# EasyEDA schematic SCH_DMM_PCB_Final_2024-05-03.json
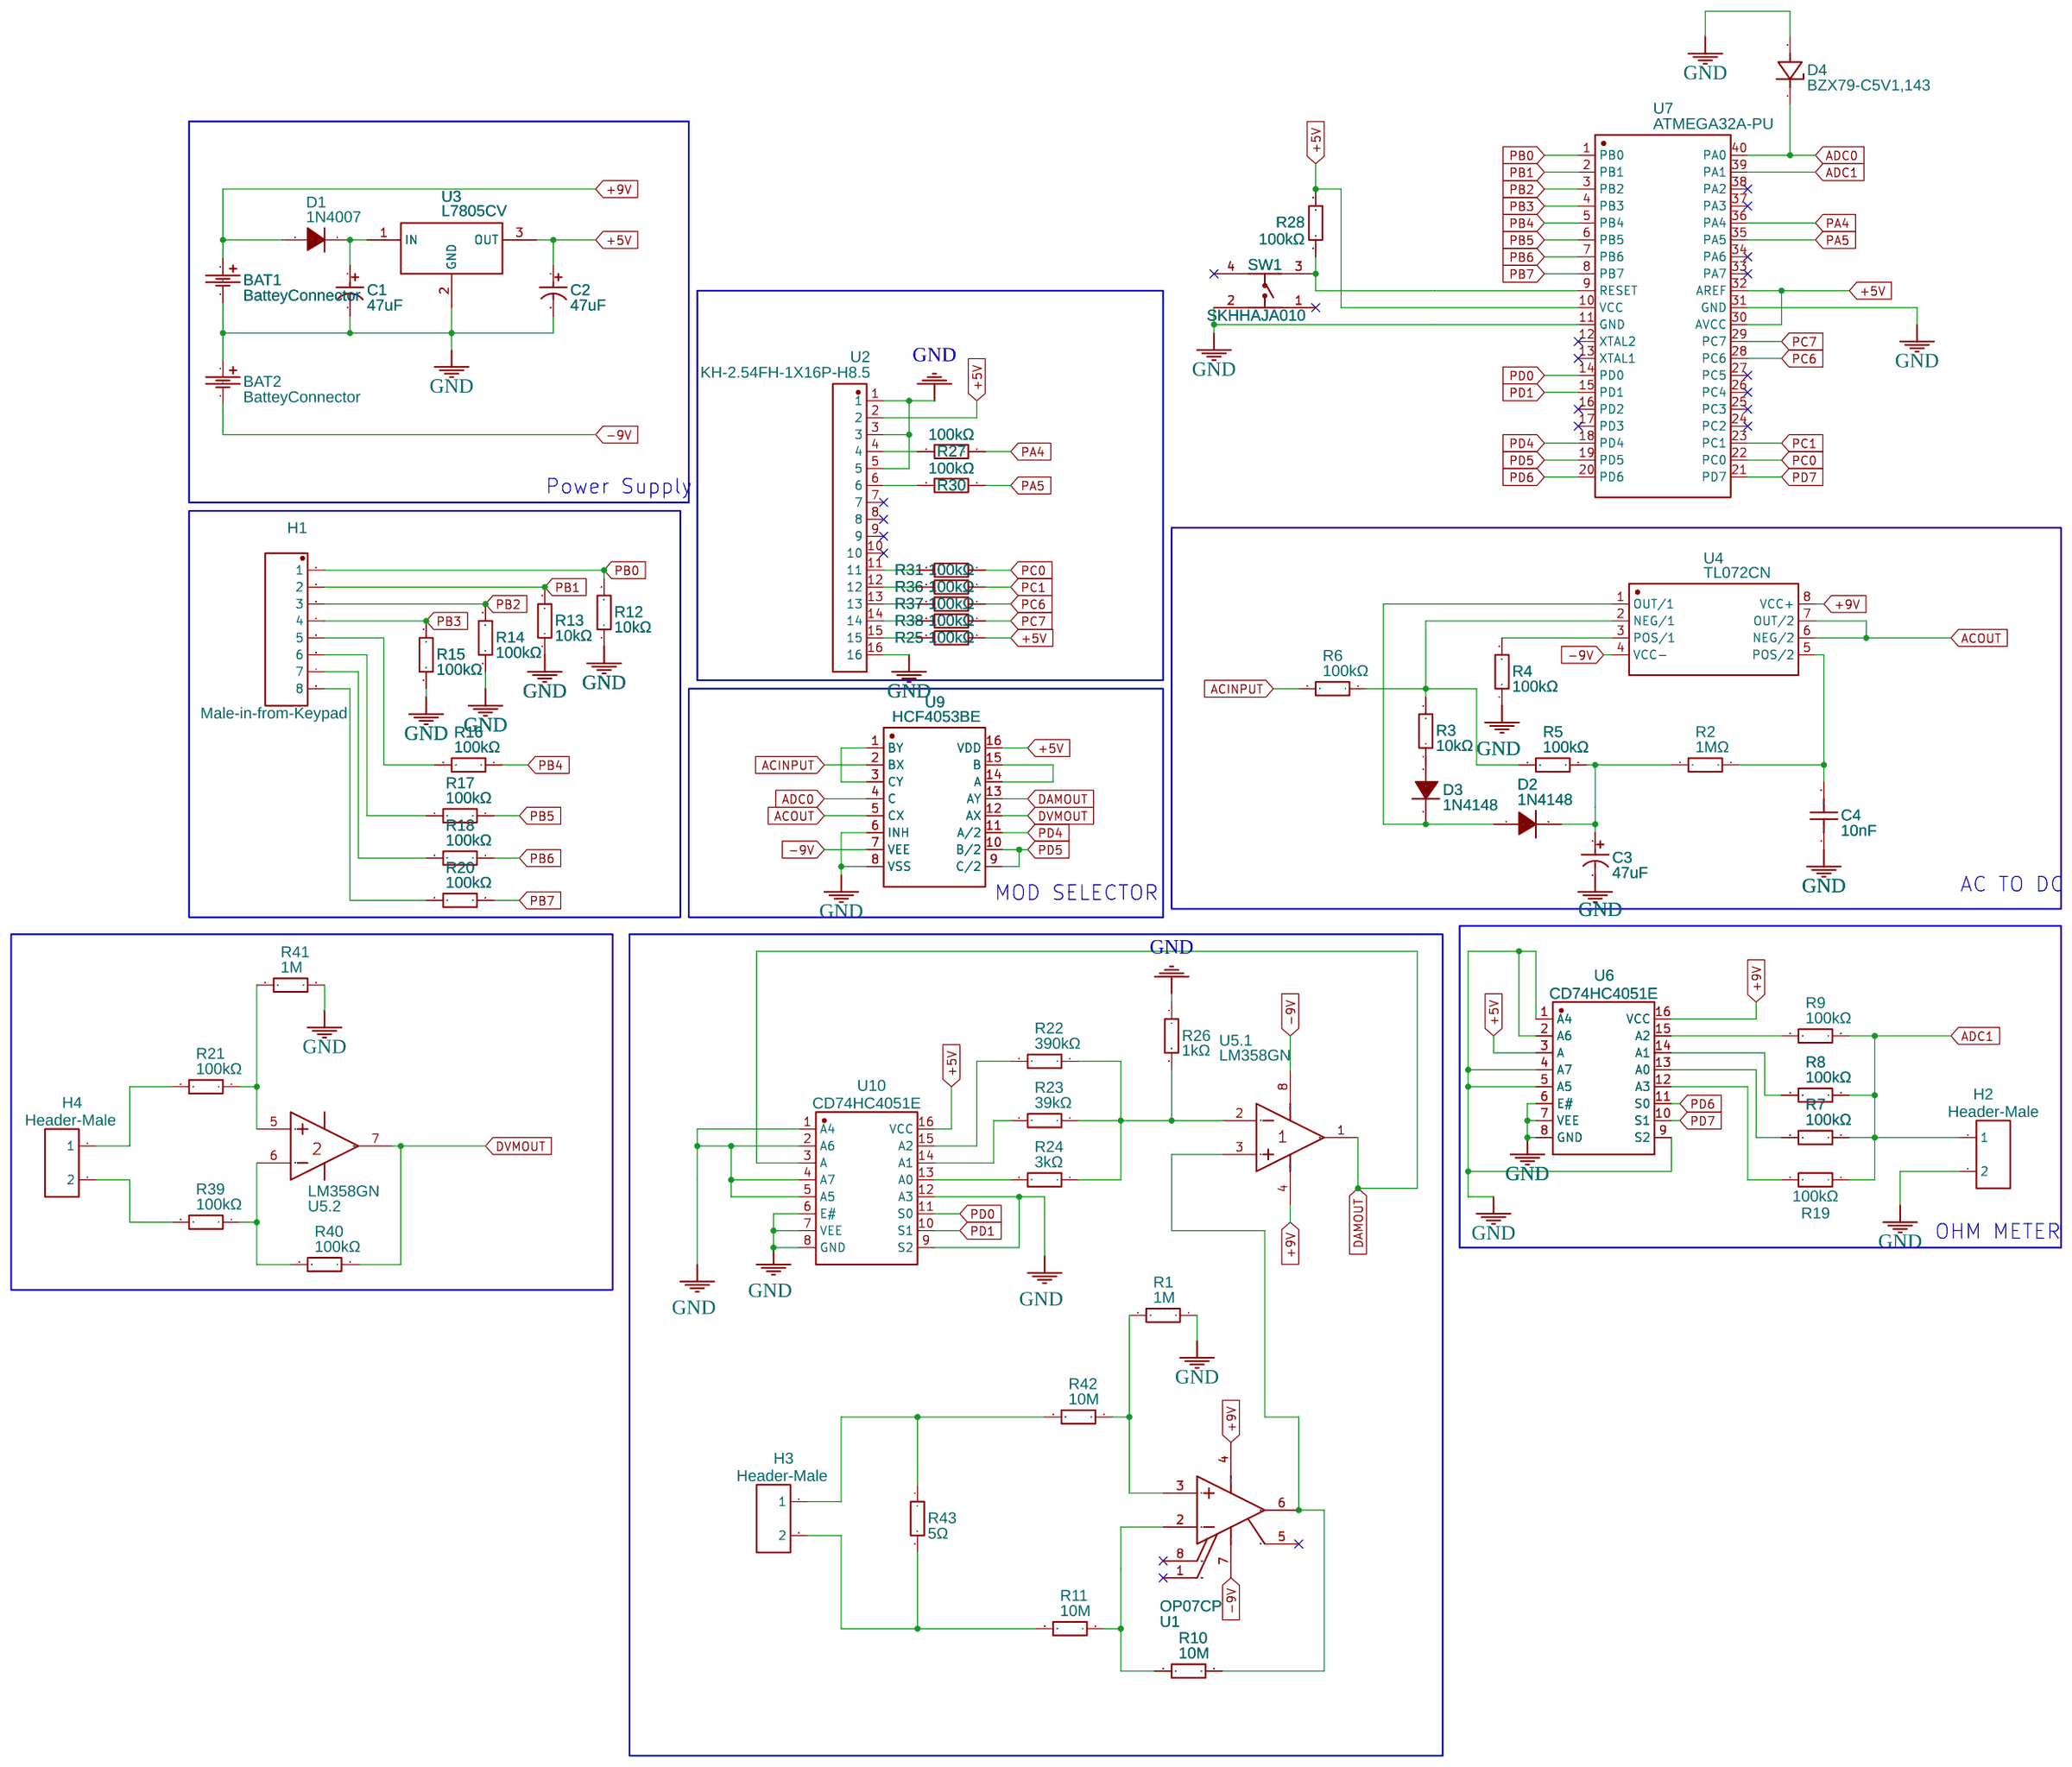
[diagram p0: schematic sheet]

## Parts
BAT1  BatteyConnector  [BATT-CONN-FP]
BAT2  BatteyConnector  [BATT-CONN-FP]
C1  47uF  [CAP-TH_BD5.0-P2.00-D0.8-FD]
C2  47uF  [CAP-TH_BD5.0-P2.00-D0.8-FD]
C3  47uF  [CAP-TH_BD5.0-P2.00-D0.8-FD]
C4  10nF  [CAP-TH_L5.0-W2.5-P2.54-D0.7]
D1  1N4007  [DO-41_BD2.4-L4.7-P8.70-D0.9-RD]
D2  1N4148  [DO-35_BD2.0-L4.0-P8.00-D0.5-FD]
D3  1N4148  [DO-35_BD2.0-L4.0-P8.00-D0.5-FD]
D4  BZX79-C5V1,143  [SOD-27_BD1.9-L4.3-P8.25-D0.6-RD]
H1  Male-in-from-Keypad  [HDR-TH_8P-P2.54-V-M]
H2  Header-Male  [HDR-TH_2P-P2.54-V-M-1]
H3  Header-Male  [HDR-TH_2P-P2.54-V-M-1]
H4  Header-Male  [HDR-TH_2P-P2.54-V-M-1]
R1  1M  [RES-TH_BD2.3-L3.7-P7.70-D0.9]
R2  1MΩ  [RES-TH_BD2.3-L3.7-P7.70-D0.9]
R3  10kΩ  [RES-TH_BD2.3-L3.7-P7.70-D0.9]
R4  100kΩ  [RES-TH_BD2.3-L3.7-P7.70-D0.9]
R5  100kΩ  [RES-TH_BD2.3-L3.7-P7.70-D0.9]
R6  100kΩ  [RES-TH_BD2.3-L3.7-P7.70-D0.9]
R7  100kΩ  [RES-TH_BD2.3-L3.7-P7.70-D0.9]
R8  100kΩ  [RES-TH_BD2.3-L3.7-P7.70-D0.9]
R9  100kΩ  [RES-TH_BD2.3-L3.7-P7.70-D0.9]
R10  10M  [RES-TH_BD2.3-L3.7-P7.70-D0.9]
R11  10M  [RES-TH_BD2.3-L3.7-P7.70-D0.9]
R12  10kΩ  [RES-TH_BD2.3-L3.7-P7.70-D0.9]
R13  10kΩ  [RES-TH_BD2.3-L3.7-P7.70-D0.9]
R14  100kΩ  [RES-TH_BD2.3-L3.7-P7.70-D0.9]
R15  100kΩ  [RES-TH_BD2.3-L3.7-P7.70-D0.9]
R16  100kΩ  [RES-TH_BD2.3-L3.7-P7.70-D0.9]
R17  100kΩ  [RES-TH_BD2.3-L3.7-P7.70-D0.9]
R18  100kΩ  [RES-TH_BD2.3-L3.7-P7.70-D0.9]
R19  100kΩ  [RES-TH_BD2.3-L3.7-P7.70-D0.9]
R20  100kΩ  [RES-TH_BD2.3-L3.7-P7.70-D0.9]
R21  100kΩ  [RES-TH_BD2.3-L3.7-P7.70-D0.9]
R22  390kΩ  [RES-TH_BD2.3-L3.7-P7.70-D0.9]
R23  39kΩ  [RES-TH_BD2.3-L3.7-P7.70-D0.9]
R24  3kΩ  [RES-TH_BD2.3-L3.7-P7.70-D0.9]
R25  100kΩ  [RES-TH_BD2.3-L3.7-P7.70-D0.9]
R26  1kΩ  [RES-TH_BD2.3-L3.7-P7.70-D0.9]
R27  100kΩ  [RES-TH_BD2.3-L3.7-P7.70-D0.9]
R28  100kΩ  [RES-TH_BD2.3-L3.7-P7.70-D0.9]
R30  100kΩ  [RES-TH_BD2.3-L3.7-P7.70-D0.9]
R31  100kΩ  [RES-TH_BD2.3-L3.7-P7.70-D0.9]
R36  100kΩ  [RES-TH_BD2.3-L3.7-P7.70-D0.9]
R37  100kΩ  [RES-TH_BD2.3-L3.7-P7.70-D0.9]
R38  100kΩ  [RES-TH_BD2.3-L3.7-P7.70-D0.9]
R39  100kΩ  [RES-TH_BD2.3-L3.7-P7.70-D0.9]
R40  100kΩ  [RES-TH_BD2.3-L3.7-P7.70-D0.9]
R41  1M  [RES-TH_BD2.3-L3.7-P7.70-D0.9]
R42  10M  [RES-TH_BD2.3-L3.7-P7.70-D0.9]
R43  5Ω  [RES-TH_BD2.3-L3.7-P7.70-D0.9]
SW1  SKHHAJA010  [KEY-TH_4P-L6.0-W6.0-P4.50]
U1  OP07CP  [DIP-8_L9.6-W6.4-P2.54-LS7.6-BL-1]
U2  KH-2.54FH-1X16P-H8.5  [HDR-TH_16P-P2.54-V-F-B]
U3  L7805CV  [TO-220-3_L10.0-W4.5-P2.54-L]
U4  TL072CN  [DIP-8_L9.4-W6.4-P2.54-LS9.1-BL]
U5  LM358GN  [DIP-8_L9.8-W6.6-P2.54-LS7.6-BL]  (sections 1,2)
U6  CD74HC4051E  [DIP-16_L20.0-W6.4-P2.54-LS7.6-BL]
U7  ATMEGA32A-PU  [DIP-40_L52.3-W13.9-P2.54-LS15.2-BL]
U9  HCF4053BE  [DIP-16_16P-L20.2-W6.6-P2.54-LS7.6-BL]
U10  CD74HC4051E  [DIP-16_L20.0-W6.4-P2.54-LS7.6-BL]

## Library data of the parts
BAT1 BAT2 = BatteyConnector: Contributor: SparkFun
C1-C3 = 25YXF47MEFC5X11: Supplier: LCSC; Manufacturer: rubycon(红宝石); Supplier Part: C88724; JLCPCB Part Class: Extended Part
C4 = CC1H103ZA1FD3F4D10MF: Contributor: LCSC; Supplier: LCSC; Supplier Part: C254083; Manufacturer: Dersonic(德尔创); JLCPCB Part Class: Extended Part
D1 = 1N4007: Supplier: LCSC; Manufacturer: ST(先科); Supplier Part: C106903; JLCPCB Part Class: Extended Part
D2 D3 = 1N4148: Supplier: LCSC; Manufacturer: ST(先科); Supplier Part: C14516; JLCPCB Part Class: Extended Part
D4 = BZX79-C5V1,143: Contributor: LCSC; Supplier: LCSC; Supplier Part: C550863; Manufacturer: Nexperia(安世); JLCPCB Part Class: Extended Part
H1 = Header-Male-2.54_1x8: Contributor: LCSC; Supplier: LCSC; Manufacturer: Ckmtw(灿科盟); Manufacturer Part: B-2100S08P-A110; Supplier Part: C124381; JLCPCB Part Class: Extended Part
H2-H4 = Header-Male-2.54_1x2: Supplier: LCSC; Manufacturer: TE Connectivity(泰科电子); Manufacturer Part: 826629-2; Supplier Part: C86471; JLCPCB Part Class: Extended Part
R1-R28 R30 R31 R36-R43 = CR1/8W ±5% 10M OTB5: Contributor: LCSC; Supplier: LCSC; Supplier Part: C337030; Manufacturer: VO(翔胜); JLCPCB Part Class: Extended Part
SW1 = SKHHAJA010: Supplier: LCSC; Manufacturer: ALPSALPINE(阿尔卑斯阿尔派); Supplier Part: C97440; JLCPCB Part Class: Extended Part
U1 = OP07CP: Supplier: LCSC; Manufacturer: TI(德州仪器); Supplier Part: C5224; JLCPCB Part Class: Extended Part
U2 = KH-2.54FH-1X16P-H8.5: Contributor: LCSC; Supplier: LCSC; Supplier Part: C2905421; Manufacturer: kinghelm(金航标); JLCPCB Part Class: Extended Part
U3 = L7805CV: Supplier: LCSC; Manufacturer: ST(意法半导体); Supplier Part: C111887; JLCPCB Part Class: Extended Part
U4 = TL072CN: Supplier: LCSC; Manufacturer: STMicroelectronics; Supplier Part: C5164
U5 = LM358GN: subpart_no: 1; Supplier: LCSC; Supplier Part: C2902318; Manufacturer: HTC; JLCPCB Part Class: Extended Part
U6 U10 = CD74HC4051E: Contributor: LCSC; Supplier: LCSC; Supplier Part: C205976; Manufacturer: TI(德州仪器); JLCPCB Part Class: Extended Part
U7 = ATMEGA32A-PU: Supplier: LCSC; Manufacturer: MICROCHIP(美国微芯); Supplier Part: C12703; JLCPCB Part Class: Extended Part
U9 = HCF4053BE: Supplier: LCSC; Manufacturer: ST(意法半导体); Supplier Part: C5169; JLCPCB Part Class: Extended Part

## Nets
+5V: C2.1 R25.1 R28.2 U2.2 U3.3(OUT) U6.3(A) U7.10(VCC) U7.30(AVCC) U7.32(AREF) U9.16(VDD) U10.16(VCC)
+9V: BAT1.V+ D1.2(A) U1.4(VCC-) U4.8(VCC+) U5.4(GND) U6.16(VCC)
-9V: BAT2.V- U1.7(VCC+) U4.4(VCC-) U5.8(VCC) U9.7(VEE)
GND: BAT1.V- BAT2.V+ C1.2 C2.2 C3.2 C4.1 D4.2(A) H2.2 R1.1 R4.1 R12.1 R13.1 R14.1 R15.1 R26.1 R41.1 SW1.2 U2.1 U2.3 U2.5 U2.16 U3.2(GND) U6.1(A4) U6.2(A6) U6.4(A7) U6.5(A5) U6.6(E#) U6.7(VEE) U6.8(GND) U6.9(S2) U7.11(GND) U7.31(GND) U9.6(INH) U9.8(VSS) U10.1(A4) U10.2(A6) U10.4(A7) U10.5(A5) U10.6(E#) U10.7(VEE) U10.8(GND) U10.9(S2) U10.12(A3)
ACINPUT: R6.2 U9.2(BX)
ACOUT: U4.6(NEG/2) U4.7(OUT/2) U9.5(CX)
ADC0: D4.1(C) U7.40(PA0) U9.4(C)
ADC1: H2.1 R7.1 R8.1 R9.1 R19.1 U7.39(PA1)
DAMOUT: U5.1(OUT1) U9.13(AY) U10.3(A)
DVMOUT: R40.1 U5.7(OUT2) U9.12(AX)
PA4: R27.1 U7.36(PA4)
PA5: R30.1 U7.35(PA5)
PB0: H1.1 R12.2 U7.1(PB0)
PB1: H1.2 R13.2 U7.2(PB1)
PB2: H1.3 R14.2 U7.3(PB2)
PB3: H1.4 R15.2 U7.4(PB3)
PB4: R16.1 U7.5(PB4)
PB5: R17.1 U7.6(PB5)
PB6: R18.1 U7.7(PB6)
PB7: R20.1 U7.8(PB7)
PC0: R31.1 U7.22(PC0)
PC1: R36.1 U7.23(PC1)
PC6: R37.1 U7.28(PC6)
PC7: R38.1 U7.29(PC7)
PD0: U7.14(PD0) U10.11(S0)
PD1: U7.15(PD1) U10.10(S1)
PD4: U7.18(PD4) U9.11(A/2)
PD5: U7.19(PD5) U9.9(C/2) U9.10(B/2)
PD6: U6.11(S0) U7.20(PD6)
PD7: U6.10(S1) U7.21(PD7)
Net-(C1-1): C1.1 D1.1(K) U3.1(IN)
Net-(C3-1): C3.1 D2.2(C) R2.1 R5.1
Net-(C4-2): C4.2 R2.2 U4.5(POS/2)
Net-(D2-1): D2.1(A) D3.2(C) U4.1(OUT/1)
Net-(D3-1): D3.1(A) R3.1
Net-(H1-5): H1.5 R16.2
Net-(H1-6): H1.6 R17.2
Net-(H1-7): H1.7 R18.2
Net-(H1-8): H1.8 R20.2
Net-(H3-1): H3.1 R42.2 R43.1
Net-(H3-2): H3.2 R11.2 R43.2
Net-(H4-1): H4.1 R21.2
Net-(H4-2): H4.2 R39.2
Net-(R1-2): R1.2 R42.1 U1.3(IN+)
Net-(R3-2): R3.2 R5.2 R6.1 U4.2(NEG/1)
Net-(R4-2): R4.2 U4.3(POS/1)
Net-(R7-2): R7.2 U6.13(A0)
Net-(R8-2): R8.2 U6.14(A1)
Net-(R9-2): R9.2 U6.15(A2)
Net-(R10-1): R10.1 U1.6(OUT) U5.3(+IN1)
Net-(R10-2): R10.2 R11.1 U1.2(IN-)
Net-(R19-2): R19.2 U6.12(A3)
Net-(R21-1): R21.1 R41.2 U5.5(+IN2)
Net-(R22-1): R22.1 R23.1 R24.1 R26.2 U5.2(-IN1)
Net-(R22-2): R22.2 U10.15(A2)
Net-(R23-2): R23.2 U10.14(A1)
Net-(R24-2): R24.2 U10.13(A0)
Net-(R25-2): R25.2 U2.15
Net-(R27-2): R27.2 U2.4
Net-(R28-1): R28.1 SW1.3 U7.9(RESET)
Net-(R30-2): R30.2 U2.6
Net-(R31-2): R31.2 U2.11
Net-(R36-2): R36.2 U2.12
Net-(R37-2): R37.2 U2.13
Net-(R38-2): R38.2 U2.14
Net-(R39-1): R39.1 R40.2 U5.6(-IN1)
Net-(U9-1): U9.1(BY) U9.3(CY)
Net-(U9-14): U9.14(A) U9.15(B)

Not connected (* = marked no-connect by the designer): SW1 1* 4*; U1 1(OFFSET_N1)* 5(NC)* 8(OFFSET_N2)*; U2 7* 8* 9* 10*; U7 12(XTAL2)* 13(XTAL1)* 16(PD2)* 17(PD3)* 24(PC2)* 25(PC3)* 26(PC4)* 27(PC5)* 33(PA7)* 34(PA6)* 37(PA3)* 38(PA2)*

## Notes on the sheet
- Power Supply
- MOD SELECTOR
- AC TO DC
- OHM METER
